# EAGLE design main_board (EAGLE 8.7.0)
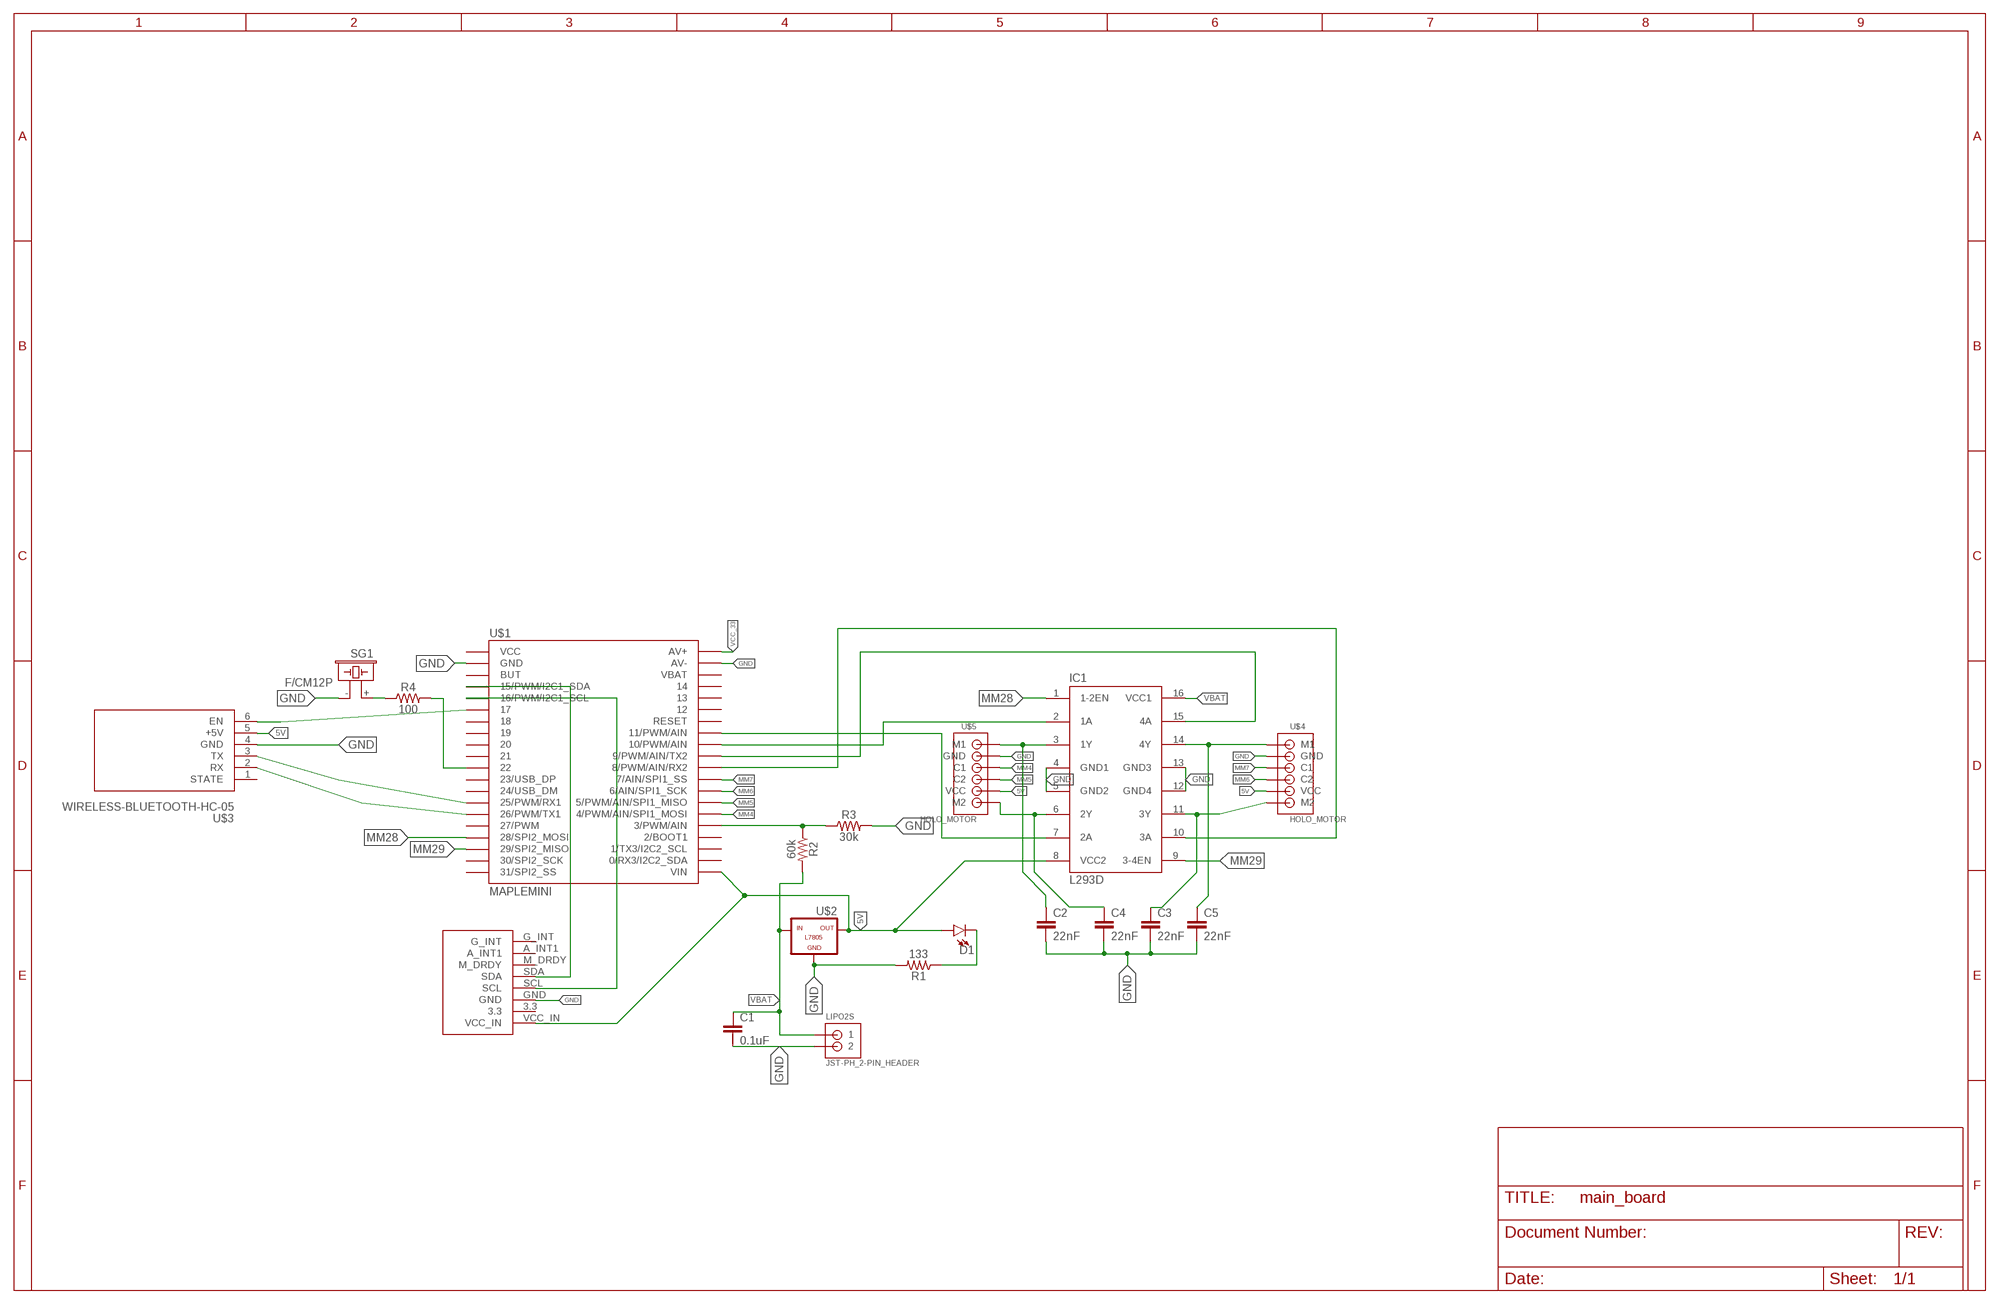
[diagram p0: schematic, sheet 1]

## Parts
C1  0.1uF  0.1UF-0603-25V-(+80/-20%)  [0603]
C2  22nF  22NF/22,000PF-0603-50V-10%  [0603]
C3  22nF  22NF/22,000PF-0603-50V-10%  [0603]
C4  22nF  22NF/22,000PF-0603-50V-10%  [0603]
C5  22nF  22NF/22,000PF-0603-50V-10%  [0603]
D1  LED-FKIT-1206  [FKIT-LED-1206]
IC1  L293D  [DIL16]
LIPO2S  JST-PH_2-PIN_HEADER  [JST_B2B-PH_HEADER]
R1  133  0.27OHM-0603-1/10W-1%  [0603]
R2  60k  0.27OHM-0603-1/10W-1%  [0603]
R3  30k  0.27OHM-0603-1/10W-1%  [0603]
R4  100  0.27OHM-0603-1/10W-1%  [0603]
SG1  F/CM12P  [F/CM12P]
U$1  MAPLEMINI  [20-DIP]
U$2  -L7805  [L7805]
U$3  WIRELESS-BLUETOOTH-HC-05  [WIRELESS-BLUETOOTH-HC-05]
U$4  HOLO_MOTOR  [HOLO_MOTOR]
U$5  HOLO_MOTOR  [HOLO_MOTOR]
U$6  GY-85  [GY-85]

## Nets
5V: D1.A IC1.8(VCC2) U$1.21(VIN) U$2.OUT U$3.5(+5V) U$4.5(VCC) U$5.5(VCC) U$6.VCC_IN
GND: C1.2 C2.2 C3.2 C4.2 C5.2 IC1.4(GND1) IC1.5(GND2) IC1.12(GND4) IC1.13(GND3) LIPO2S.P2 R1.2 R3.2 SG1.- U$1.2(GND) U$1.39(AV-) U$2.GND U$3.4(GND) U$4.2(GND) U$5.2(GND) U$6.GND
MM4: U$1.26(4/PWM/AIN/SPI1_MOSI) U$5.3(C1)
MM5: U$1.27(5/PWM/AIN/SPI1_MISO) U$5.4(C2)
MM6: U$1.28(6/AIN/SPI1_SCK) U$4.4(C2)
MM7: U$1.29(7/AIN/SPI1_SS) U$4.3(C1)
MM28: IC1.1(1-2EN) U$1.17(28/SPI2_MOSI)
MM29: IC1.9(3-4EN) U$1.18(29/SPI2_MISO)
N$1: D1.C R1.1
N$2: R4.2 U$1.11
N$3: IC1.10(3A) U$1.30(8/PWM/AIN/RX2)
N$4: U$1.15(26/PWM/TX1) U$3.2(RX)
N$5: U$1.14(25/PWM/RX1) U$3.3(TX)
N$6: U$1.5(16/PWM/I2C1_SCL) U$6.SCL
N$7: C5.1 IC1.14(4Y) U$4.1(M1)
N$8: U$1.6 U$3.6(EN)
N$9: R2.1 R3.1 U$1.25(3/PWM/AIN)
N$10: IC1.7(2A) U$1.33(11/PWM/AIN)
N$11: IC1.2(1A) U$1.32(10/PWM/AIN)
N$12: IC1.15(4A) U$1.31(9/PWM/AIN/TX2)
N$13: U$1.4(15/PWM/I2C1_SDA) U$6.SDA
N$14: R4.1 SG1.+
N$15: C2.1 IC1.3(1Y) U$5.1(M1)
N$16: C3.1 IC1.11(3Y) U$4.6(M2)
N$17: C4.1 IC1.6(2Y) U$5.6(M2)
VBAT: C1.1 IC1.16(VCC1) LIPO2S.P1 R2.2 U$2.IN
VCC_33: U$1.40(AV+)
Unconnected: U$1.1(VCC) U$1.3(BUT) U$1.7 U$1.8 U$1.9 U$1.10 U$1.12(23/USB_DP) U$1.13(24/USB_DM) U$1.16(27/PWM) U$1.19(30/SPI2_SCK) U$1.20(31/SPI2_SS) U$1.22(0/RX3/I2C2_SDA) U$1.23(1/TX3/I2C2_SCL) U$1.24(2/BOOT1) U$1.34(RESET) U$1.35 U$1.36 U$1.37 U$1.38(VBAT) U$3.1(STATE) U$6.3.3 U$6.A_INT1 U$6.G_INT U$6.M_DRDY

## Library data of the parts
C1 = SparkFun-Capacitors:0.1UF: 0.1µF ceramic capacitors A capacitor is a passive two-terminal electrical component used to store electrical energy temporarily in an electric field.; PROD_ID: CAP-00810
C2-C5 = SparkFun-Capacitors:22NF/22,000PF: 0.022uF/22nF/22,000pF ceramic capacitors A capacitor is a passive two-terminal electrical component used to store electrical energy temporarily in an electric field.; PROD_ID: CAP-07885
D1 = SparkFun-LED:LED: LED (Generic) Standard schematic elements and footprints for 5mm, 3mm, 1206, and 0603 sized LEDs. Generic LEDs with no color specified.
IC1 = st-microelectronics:L293D: PUSH-PULL 4 CHANNEL DRIVER; MPN: L293D; OC_FARNELL: 9589619; OC_NEWARK: 56P8249
LIPO2S = srg:JST-PH_2-PIN_HEADER: 2-pin JST PH Shrouded Header, top entry P/N B2B-PH-K-S Mating connector PHR-2 Mating cable assembly: Sparkfun PRT-09914 <http://www.sparkfun.com/products/9914>
R1-R4 = SparkFun-Resistors:0.27OHM: 0.27Ω resistor A resistor is a passive two-terminal electrical component that implements electrical resistance as a circuit element. Resistors act to reduce current flow, and, at the same time, act to lower voltage levels within circuits. - Wikipedia; PROD_ID: RES-08787; VALUE: 0.27
SG1 = buzzer:F/CM12P: BUZZER Source: Buerklin; OC_FARNELL: unknown; OC_NEWARK: unknown
U$1 = maplemini:MAPLEMINI
U$2 = tango:-L7805
U$3 = diy-modules:WIRELESS-BLUETOOTH-HC-05: Bluetooth Transceiver Module based on HC-05 board Tutorial is available here: https://arduino-info.wikispaces.com/BlueTooth-HC05-HC06-Modules-How-To Click here to find device on ebay.com <http://www.ebay.com/sch/hc-05+module+rs232>
U$4 U$5 = jst:HOLO_MOTOR
U$6 = rhoban:GY-85

## Board
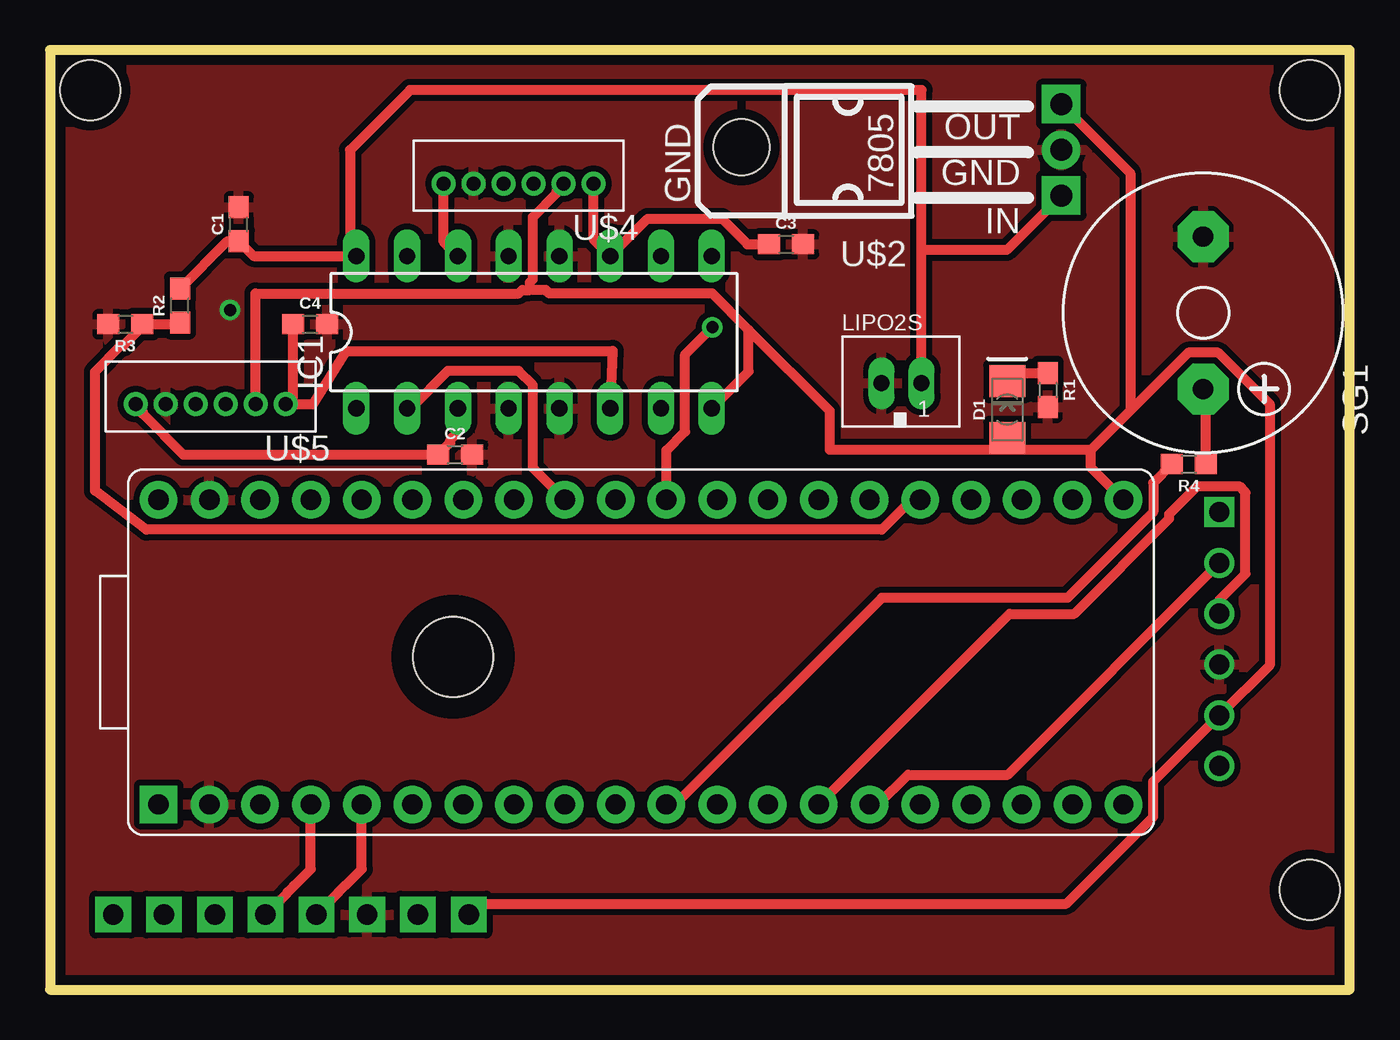
[diagram p1: board, top side]
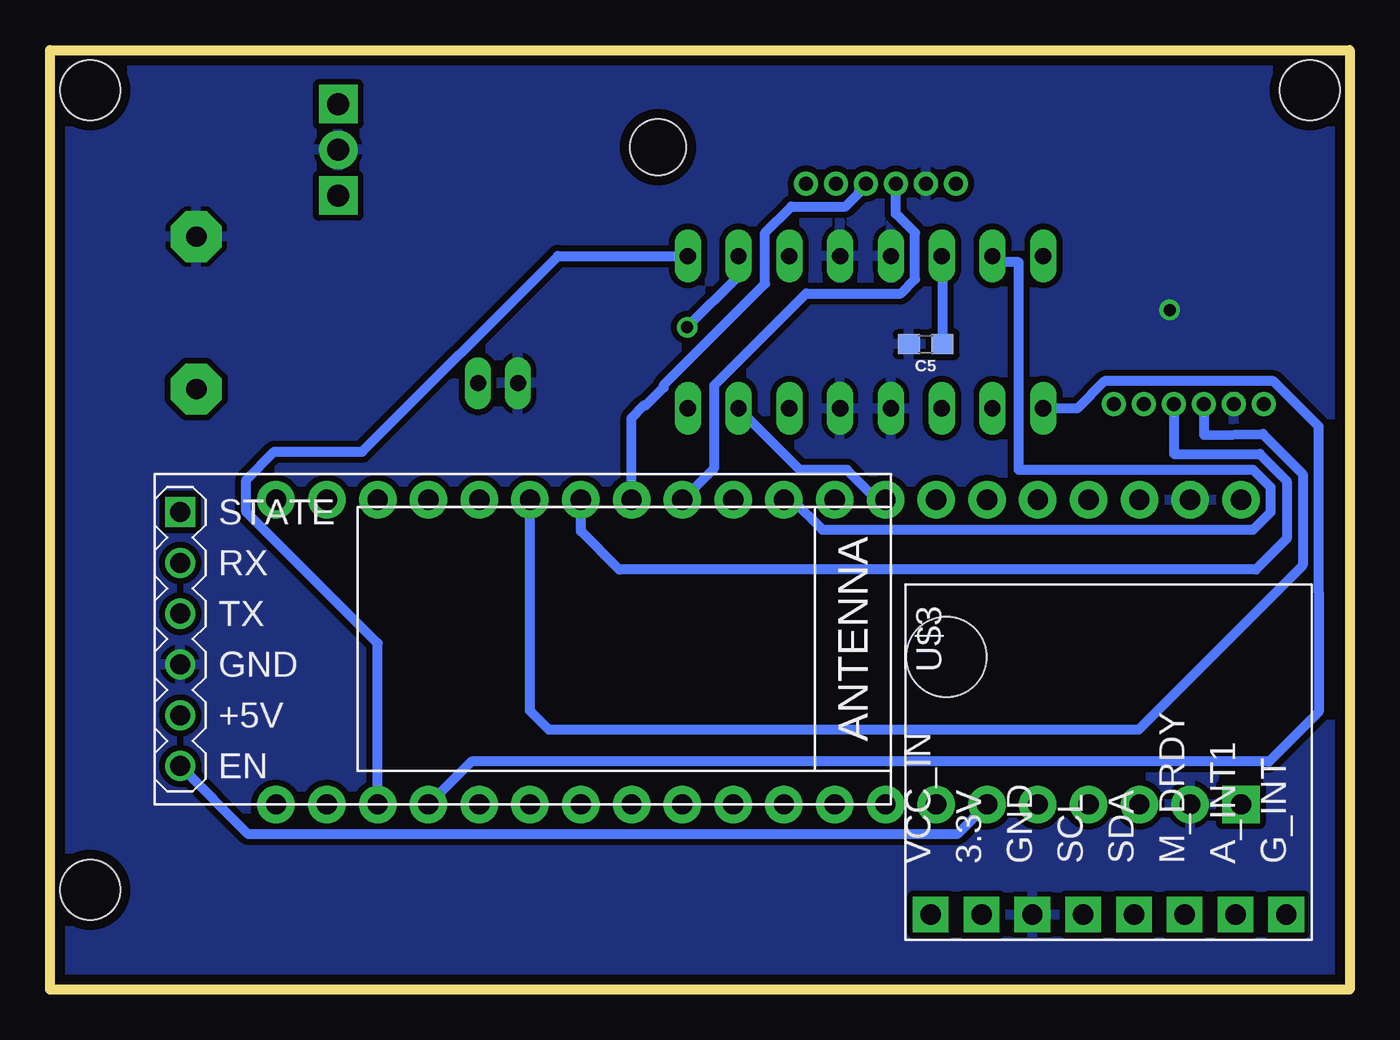
[diagram p2: board, bottom side, seen from below]

Size 65 x 47 mm. Coordinates in mm from the lower left corner, seen from the top.
Outline: 0,0 65,0 65,47 0,47 0,0
Copper layers (1*16): Top 0.035mm / dielectric 1.5mm / Bottom 0.035mm
Design rules "default *": minimum track width 0.5mm, minimum drill 0.6mm, track to track 0.3mm, track to pad 0.3mm, pad to pad 0.2mm, via to via 0.3mm, smd to smd 0.2mm, copper to edge 0.5mm, drill to drill 6mil, minimum pad ring 10mil, minimum via ring 8mil, stop-mask expansion 4mil, vias tented up to drill 0mil, thermal gap 10mil
Holes 3 mm at 63,45 63,5 2,45

### Footprints (pad centres in the part's own frame; a part is rotated, then mirrored left to right if it is on the bottom)
0603 = smd 1.1 x 1: 1 -0.85,0; 2 0.85,0
FKIT-LED-1206 = smd 1.6 x 1.803: A -1.422,0; C 1.422,0
DIL16 = drill 0.813 long: 1 -8.89,-3.81; 2 -6.35,-3.81; 3 -3.81,-3.81; 4 -1.27,-3.81; 5 1.27,-3.81; 6 3.81,-3.81; 7 6.35,-3.81; 8 8.89,-3.81; 9 8.89,3.81; 10 6.35,3.81; 11 3.81,3.81; 12 1.27,3.81; 13 -1.27,3.81; 14 -3.81,3.81; 15 -6.35,3.81; 16 -8.89,3.81
JST_B2B-PH_HEADER = drill 0.8 long: P1 1.075,0.048; P2 -0.925,0.048
F/CM12P = drill 1.016 pad 2.54 octagon: + 3.81,0; - -3.81,0
20-DIP = drill 1.016 pad 1.88 square: 1 -24.13,-7.62 | drill 1.016 pad 1.88: 2 -21.59,-7.62; 3 -19.05,-7.62; 4 -16.51,-7.62; 5 -13.97,-7.62; 6 -11.43,-7.62; 7 -8.89,-7.62; 8 -6.35,-7.62; 9 -3.81,-7.62; 10 -1.27,-7.62; 11 1.27,-7.62; 12 3.81,-7.62; 13 6.35,-7.62; 14 8.89,-7.62; 15 11.43,-7.62; 16 13.97,-7.62; 17 16.51,-7.62; 18 19.05,-7.62; 19 21.59,-7.62; 20 24.13,-7.62; 21 24.13,7.62; 22 21.59,7.62; 23 19.05,7.62; 24 16.51,7.62; 25 13.97,7.62; 26 11.43,7.62; 27 8.89,7.62; 28 6.35,7.62; 29 3.81,7.62; 30 1.27,7.62; 31 -1.27,7.62; 32 -3.81,7.62; 33 -6.35,7.62; 34 -8.89,7.62; 35 -11.43,7.62; 36 -13.97,7.62; 37 -16.51,7.62; 38 -19.05,7.62; 39 -21.59,7.62; 40 -24.13,7.62
L7805 = drill 1.1 pad 1.93: GND 0.127,-9.652 | drill 1.1 pad 1.93 square: IN -2.159,-9.652; OUT 2.413,-9.652 | hole 2.8: 0.254,6.35
WIRELESS-BLUETOOTH-HC-05 = drill 1 square: 1 -6.35,-17.145 | drill 1: 2 -3.81,-17.145; 3 -1.27,-17.145; 4 1.27,-17.145; 5 3.81,-17.145; 6 6.35,-17.145
HOLO_MOTOR = drill 0.7: 1 9,-1.3; 2 7.5,-1.3; 3 6,-1.3; 4 4.5,-1.3; 5 3,-1.3; 6 1.5,-1.3
GY-85 = drill 1.016 pad 1.778 square: 3.3 0,15.24; A_INT1 0,2.54; G_INT 0,0; GND 0,12.7; M_DRDY 0,5.08; SCL 0,10.16; SDA 0,7.62; VCC_IN 0,17.78 | hole 4: 12.9,17

### Placement (x,y rotation side)
C1  9.44,38.28 90 top
C2  20.27,26.76 0 top
C3  36.82,37.28 0 top
C4  13.01,33.28 0 top
C5  21.2,32.28 180 bottom
D1  47.88,29.01 90 top
IC1  24.21,32.88 0 top
LIPO2S  42.52,30.28 0 top
R1  49.91,29.99 270 top
R2  6.5,34.22 90 top
R3  3.77,33.28 180 top
R4  56.96,26.28 180 top
SG1  57.68,33.85 270 top
U$1  29.56,16.88 0 top
U$2  40.93,41.88 90 top
U$3  41.35,17.53 270 bottom
U$4  28.69,39.02 180 top
U$5  13.28,27.98 180 top
U$6  3.16,3.75 90 bottom

### Tracks (layer width: path | path; a pad name or v marks a point on that pad's centre or on a via)
5V
  Top 0.5: 48,27 39,27 39,28.95 34.95,33 | U$6.VCC_IN 21.48,4.29 50.83,4.29 55.18,8.64 55.18,10.41 U$3.5 61,16.23 61,29.29 58.43,31.86 56.93,31.86 54.03,28.97 | IC1.8 34.95,30.92 34.95,33 | D1.A 47.88,27.12 48,27 | 24,35 24.8,35 24.98,34.82 33.13,34.82 34.95,33 | 24,35 24,35.38 24.15,35.53 24.15,38.65 25.34,39.84 25.34,39.97 U$4.5 | 24,35 23.62,35 23.44,34.82 10.28,34.82 U$5.5 | 54.03,28.97 52.07,27 | 52.07,27 48,27 | U$1.21 52.07,26.12 52.07,27 | U$2.OUT 54.03,40.84 54.03,28.97
GND  (via drill 0.6)
  other vias: 9,34
  pour Top: 0,47 0,1 65,1 65,47
  pour Bottom: 0,-3 65,-3 65,51 0,51
MM4
  Bottom 0.5: U$5.3 7.28,27.75 4.32,27.79 4.32,27.76 2.34,25.78 2.34,21.22 10.56,13 40.04,13 40.99,13.95 U$1.26
MM5
  Bottom 0.5: U$5.4 8.78,26.79 4.48,26.79 3.14,25.45 3.14,22.55 4.68,21.01 36.53,21.01 38.45,22.93 U$1.27
MM6
  Bottom 0.5: U$1.28 35.91,28.6 35.28,29.23 35.19,29.23 34.31,30.11 34.31,30.23 29.23,35.31 29.23,37.85 27.92,39.17 25.21,39.17 24.54,39.84 24.54,39.97 U$4.4
MM7
  Bottom 0.5: U$1.29 31.77,26.1 31.77,30.23 27.18,34.82 22.44,34.82 21.73,35.53 21.73,37.85 22.69,38.81 U$4.3
MM28
  Bottom 0.5: IC1.1 13.62,29.07 12.26,30.43 3.8,30.43 1.54,28.17 1.54,20 1.54,19.89 1.54,13.89 4.02,11.41 43.92,11.41 U$1.17
MM29
  Bottom 0.5: U$1.18 48.61,17.31 55.18,23.88 55.18,25.5 53.78,26.9 49.38,26.9 39.59,36.69 IC1.9
N$1
  Top 0.5: D1.C 48.29,30.84 R1.1
N$2
  Top 0.5: R4.2 55.18,25.35 55.18,23.88 50.9,19.6 41.6,19.6 31.26,9.26 U$1.11
N$3  (via drill 0.6)
  Top 0.5: U$1.30 30.83,26.97 31.77,27.91 31.77,31.77 v33.13,33.13
  Bottom 0.5: v33.13,33.13 30.56,35.69 IC1.10
N$4
  Top 0.5: U$1.15 41.42,9.26 42.91,10.75 47.91,10.75 U$3.2
N$5
  Top 0.5: U$1.14 47.99,18.8 51.23,18.8 55.98,23.55 55.98,23.78 57.39,25.18 59.48,25.18 59.8,24.86 59.8,20.8 58.5,19.5 U$3.3
N$6
  Top 0.5: U$1.5 15.59,6.02 14.76,5.19 14.75,5.19 14.42,4.87 14.42,4.85 U$6.SCL
N$7
  Top 0.5: IC1.14 19.69,37.4 U$4.1
  Bottom 0.5: C5.1 20.35,36.64 IC1.14
N$8
  Bottom 0.5: U$1.6 19.62,7.77 54,7.77 54.31,7.77 55.08,7.77 U$3.6
N$9
  Top 0.5: U$1.25 43.1,24.5 41.61,23.01 4.81,23.01 2.25,24.95 2.25,30.91 3.57,32.23 3.7,32.23 4.62,33.15 R3.1 6.41,33.28 R2.1
N$10
  Bottom 0.5: U$1.33 23.64,24.5 25.13,25.99 27.48,25.99 IC1.7
N$11
  Top 0.5: U$1.32 24.15,26.1 24.15,30.23 23.44,30.94 19.9,30.94 18.03,29.07 IC1.2
N$12
  Bottom 0.5: U$1.31 27.86,24.5 26.37,23.01 4.81,23.01 3.94,23.88 3.94,25.12 4.81,25.99 16.54,25.99 16.54,36.38 17.55,36.38 IC1.15
N$13
  Top 0.5: U$1.4 13.05,6.02 12.22,5.19 12.21,5.19 11.88,4.87 11.88,4.85 U$6.SDA
N$14
  Top 0.5: R4.1 57.81,29.91 SG1.+
N$15
  Top 0.5: U$5.1 4.63,28.93 4.63,28.8 6.67,26.76 C2.1 20.02,27.36 20.02,27.48 20.4,27.87 IC1.3
N$16
  Top 0.5: U$4.6 27.19,37.52 IC1.11 29.89,38.56 33.6,38.56 34.88,37.28 C3.1
  Bottom 0.5: IC1.11 28.43,36.69
N$17
  Top 0.5: C4.1 12.16,29.66 U$5.6 13.16,29.28 14.82,31.94 28.15,31.94 IC1.6
VBAT
  Top 0.5: 43.69,30.23 LIPO2S.P1 43.59,37 | 43.59,37 43.59,45 18,45 15,42 15,36.69 | 15,36.69 10.18,36.69 C1.1 8.87,37.43 R2.2 | 15,36.69 IC1.16 | U$2.IN 47.86,37 43.59,37